# Altium project Twintig-FCC-Host.PrjPcb
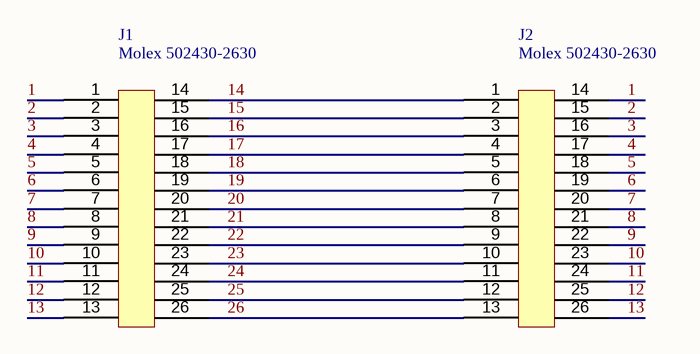
[diagram p0: Twintig-FCC-Host.SchDoc]
Version: v1.0.1; Project: Twintig FCC Host; Author: Seb Madgwick
1 sheet, 2 parts. Net scope: global (net labels, ports and power ports of the same name join across sheets).
Board file: Twintig-FCC-Host.PcbDoc

## Sheet Twintig-FCC-Host.SchDoc
size A4; SheetNumber: 1; SheetTotal: 1

### Parts
J1  Molex 502430-2630  [Molex 502430-2630]
J2  Molex 502430-2630  [Molex 502430-2630]

### Nets
1: J1.1 J2.14
2: J1.2 J2.15
3: J1.3 J2.16
4: J1.4 J2.17
5: J1.5 J2.18
6: J1.6 J2.19
7: J1.7 J2.20
8: J1.8 J2.21
9: J1.9 J2.22
10: J1.10 J2.23
11: J1.11 J2.24
12: J1.12 J2.25
13: J1.13 J2.26
14: J1.14 J2.1
15: J1.15 J2.2
16: J1.16 J2.3
17: J1.17 J2.4
18: J1.18 J2.5
19: J1.19 J2.6
20: J1.20 J2.7
21: J1.21 J2.8
22: J1.22 J2.9
23: J1.23 J2.10
24: J1.24 J2.11
25: J1.25 J2.12
26: J1.26 J2.13

### Notes on the sheet
- TITLE
- SIZE
- A4
- VARIANT
- PROJECT
- SHEET
- VERSION
- OF
- AUTHOR
- DATE